# EAGLE design main (EAGLE 6.0)
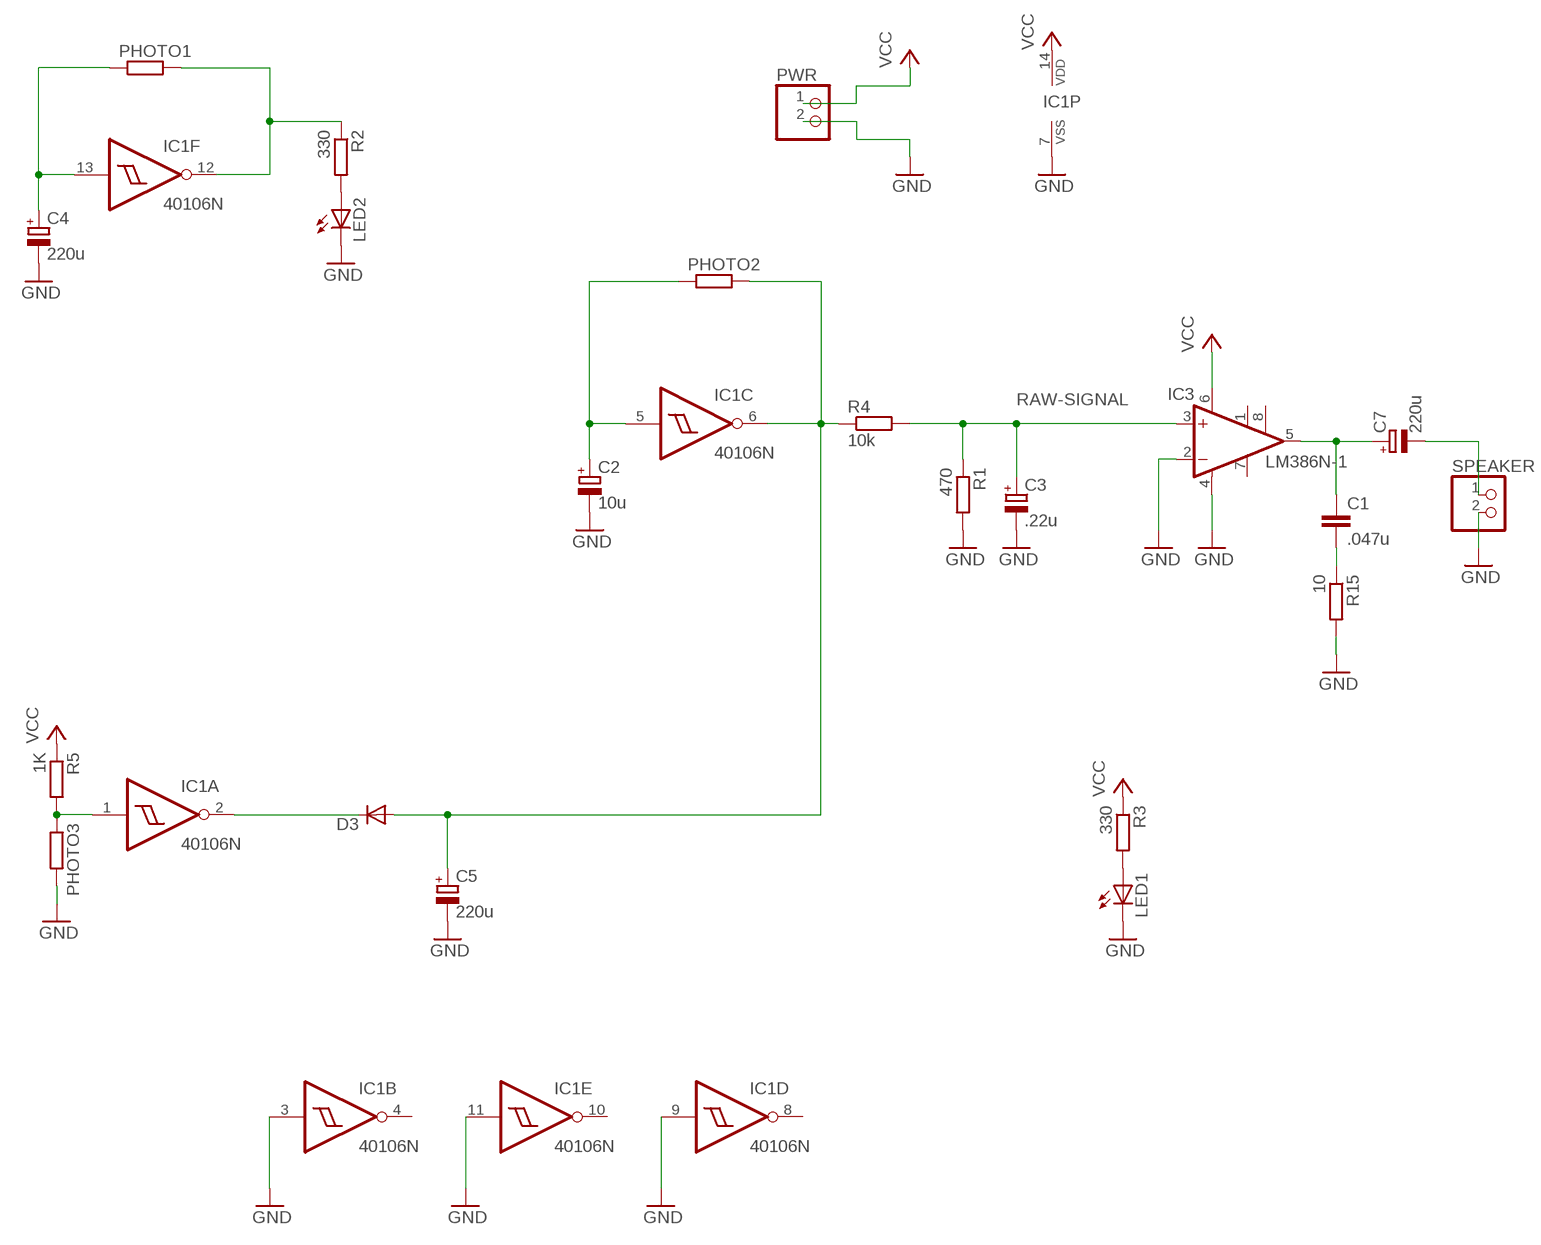
[diagram p0: schematic, sheet 1]

## Parts
C1  .047u  C-EU025-025X050  [C025-025X050]
C2  10u  CPOL-EUTT2D6  [TT2D6]
C3  .22u  CPOL-EUTT2D6  [TT2D6]
C4  220u  CPOL-EUTT2D6  [TT2D6]
C5  220u  CPOL-EUTT2D6  [TT2D6]
C7  220u  CPOL-EUTT2D6  [TT2D6]
D3  DIODE-DO35-10  [DO35-10]
IC1  40106N  [DIL14]
IC3  LM386N-1  [DIL08]
LED1  LED5MM  [LED5MM]
LED2  LED5MM  [LED5MM]
PHOTO1  R-EU_0207/5V  [0207/5V]
PHOTO2  R-EU_0207/5V  [0207/5V]
PHOTO3  R-EU_0207/5V  [0207/5V]
PWR  PINHD-1X2STRAIGHT  [1X02]
R1  470  R-EU_0207/10  [0207/10]
R2  330  R-EU_0207/10  [0207/10]
R3  330  R-EU_0207/10  [0207/10]
R4  10k  R-EU_0207/10  [0207/10]
R5  1K  R-EU_0207/10  [0207/10]
R15  10  R-EU_0207/10  [0207/10]
SPEAKER  PINHD-1X2STRAIGHT  [1X02]

## Nets
GND: C2.- C3.- C4.- C5.- IC1.3(B:I) IC1.7(P:VSS) IC1.9(D:I) IC1.11(E:I) IC3.2(-IN) IC3.4(GND) LED1.K(C) LED2.K(C) PHOTO3.2 PWR.2 R1.2 R15.2 SPEAKER.2
N$1: LED2.A R2.2
N$2: C2.+ IC1.5(C:I) PHOTO2.1
N$3: C4.+ IC1.13(F:I) PHOTO1.1
N$4: LED1.A R3.2
N$5: IC1.12(F:O) PHOTO1.2 R2.1
N$6: IC1.1(A:I) PHOTO3.1 R5.2
N$7: C5.+ D3.A IC1.6(C:O) PHOTO2.2 R4.1
N$13: D3.C IC1.2(A:O)
N$22: C1.1 C7.+ IC3.5(OUT)
N$23: C1.2 R15.1
OUT-SIGNAL: C7.- SPEAKER.1
RAW-SIGNAL: C3.+ IC3.3(+IN) R1.1 R4.2
VCC [power]: IC1.14(P:VDD) IC3.6(VS) PWR.1 R3.1 R5.1
Unconnected: IC1.4(B:O) IC1.8(D:O) IC1.10(E:O) IC3.1(GAIN) IC3.7(BYPASS) IC3.8(GAIN)

## Library data of the parts
C1 = rcl:C-EU: CAPACITOR, European symbol
C2-C5 C7 = rcl:CPOL-EU: POLARIZED CAPACITOR, European symbol
D3 = diode:DIODE-: DIODE
IC1 = 40xx:40106: Hex SCHMITT TRIGGER
IC3 = linear:LM386?-*: Low Voltage Audio Power Amplifier Source: http://cache.national.com/ds/LM/LM386.pdf
LED1 LED2 = led:LED: LED OSRAM: - CHIPLED LG R971, LG N971, LY N971, LG Q971, LY Q971, LO R971, LY R971 LH N974, LH R974 LS Q976, LO Q976, LY Q976 LO Q996 - Hyper CHIPLED LW Q18S LB Q993, LB Q99A, LB R99A - SideLED LS A670, LO A670, LY A670, LG A670, LP A670 LB A673, LV A673, LT A673, LW A673 LH A674 LY A675 LS A676, LA A676, LO A676, LY A676, LW A676 LS A679, LY A679, LG A679 - Hyper Micro SIDELED® LS Y876, LA Y876, LO Y876, LY Y876 LT Y87S - SmartLED LW L88C, LW L88S LB L89C, LB L89S, LG L890 LS L89K, LO L89K, LY L89K LS L896, LA L896, LO L896, LY L896 - TOPLED LS T670, LO T670, LY T670, LG T670, LP T670 LSG T670, LSP T670, LSY T670, LOP T670, LYG T670 LG T671, LOG T671, LSG T671 LB T673, LV T673, LT T673, LW T673 LH T674 LS T676, LA T676, LO T676, LY T676, LB T676, LH T676, LSB T676, LW T676 LB T67C, LV T67C, LT T67C, LS T67K, LO T67K, LY T67K, LW E67C LS E67B, LA E67B, LO E67B, LY E67B, LB E67C, LV E67C, LT E67C LW T67C LS T679, LY T679, LG T679 LS T770, LO T770, LY T770, LG T770, LP T770 LB T773, LV T773, LT T773, LW T773 LH T774 LS E675, LA E675, LY E675, LS T675 LS T776, LA T776, LO T776, LY T776, LB T776 LHGB T686 LT T68C, LB T68C - Hyper Mini TOPLED® LB M676 - Mini TOPLED Santana® LG M470 LS M47K, LO M47K, LY M47K Source: http://www.osram.convergy.de LUXEON: - LUMILED® LXK2-PW12-R00, LXK2-PW12-S00, LXK2-PW14-U00, LXK2-PW14-V00 LXK2-PM12-R00, LXK2-PM12-S00, LXK2-PM14-U00 LXK2-PE12-Q00, LXK2-PE12-R00, LXK2-PE12-S00, LXK2-PE14-T00, LXK2-PE14-U00 LXK2-PB12-K00, LXK2-PB12-L00, LXK2-PB12-M00, LXK2-PB14-N00, LXK2-PB14-P00, LXK2-PB14-Q00 LXK2-PR12-L00, LXK2-PR12-M00, LXK2-PR14-Q00, LXK2-PR14-R00 LXK2-PD12-Q00, LXK2-PD12-R00, LXK2-PD12-S00 LXK2-PH12-R00, LXK2-PH12-S00 LXK2-PL12-P00, LXK2-PL12-Q00, LXK2-PL12-R00 Source: www.luxeon.com KINGBRIGHT: KA-3528ASYC Source: www.kingbright.com
PHOTO1-PHOTO3 R1-R5 R15 = rcl:R-EU_: RESISTOR, European symbol
PWR SPEAKER = pinhead:PINHD-1X2: PIN HEADER

## Net classes
0 default: width 0.305 mm, clearance 0.305 mm
1 power: width 0.305 mm, clearance 0.305 mm

## Board
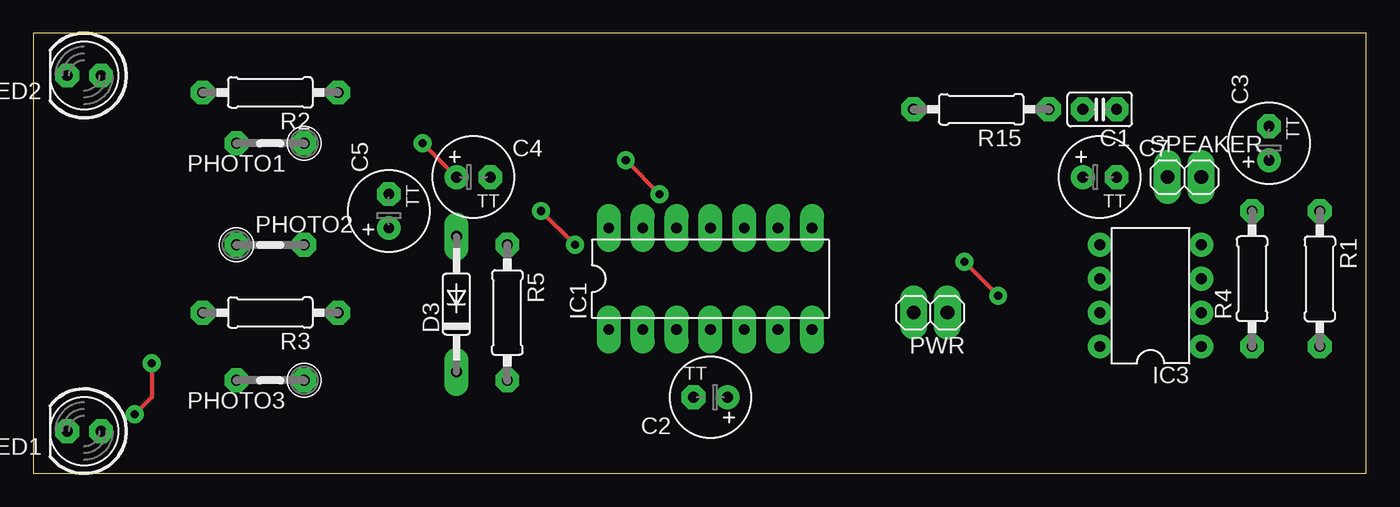
[diagram p1: board, top side]
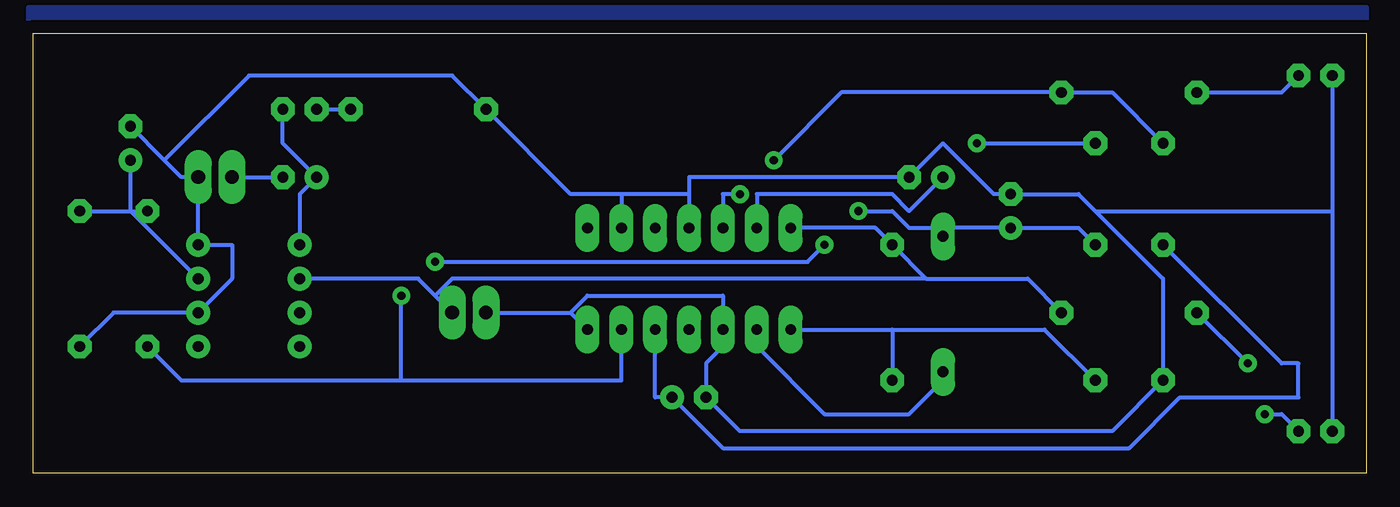
[diagram p2: board, bottom side, seen from below]

Size 100 x 33.01 mm. Coordinates in mm from the lower left corner, seen from the top.
Outline: 0,0 100,0 100,33.01 0,33.01 0,0
Copper layers (1*16): Top 0.035mm / dielectric 1.5mm / Bottom 0.035mm
Design rules: minimum track width 10mil, minimum drill 24mil, track to track 8mil, track to pad 8mil, pad to pad 8mil, via to via 8mil, smd to smd 8mil, copper to edge 40mil, drill to drill 8mil, minimum pad ring 10mil, minimum via ring 8mil, stop-mask expansion 4mil, vias tented up to drill 0mil, thermal gap 10mil

### Footprints (pad centres in the part's own frame; a part is rotated, then mirrored left to right if it is on the bottom)
C025-025X050 = drill 0.813 octagon: 1 -1.27,0; 2 1.27,0
TT2D6 = drill 0.813: + -1.27,0 | drill 0.813 octagon: - 1.27,0
DO35-10 = drill 0.813 long: A 5.08,0; C -5.08,0
DIL14 = drill 0.813 long: 1 -7.62,-3.81; 2 -5.08,-3.81; 3 -2.54,-3.81; 4 0,-3.81; 5 2.54,-3.81; 6 5.08,-3.81; 7 7.62,-3.81; 8 7.62,3.81; 9 5.08,3.81; 10 2.54,3.81; 11 0,3.81; 12 -2.54,3.81; 13 -5.08,3.81; 14 -7.62,3.81
DIL08 = drill 0.813 pad 1.27: 1 -3.81,-3.81; 2 -1.27,-3.81; 3 1.27,-3.81; 4 3.81,-3.81; 5 3.81,3.81; 6 1.27,3.81; 7 -1.27,3.81; 8 -3.81,3.81
LED5MM = drill 0.813 octagon: A -1.27,0; K 1.27,0
0207/5V = drill 0.813 octagon: 1 -2.54,0; 2 2.54,0
1X02 = drill 1.016 long: 1 -1.27,0; 2 1.27,0
0207/10 = drill 0.813 octagon: 1 -5.08,0; 2 5.08,0

### Placement (x,y rotation side)
C1  80.01,27.3 180 top
C2  50.8,5.72 180 top
C3  92.71,24.77 90 top
C4  33.02,22.23 0 top
C5  26.67,19.69 90 top
C7  80.01,22.23 0 top
D3  31.75,12.7 90 top
IC1  50.8,14.61 0 top
IC3  83.82,13.34 90 top
LED1  3.81,3.18 180 top
LED2  3.81,29.84 180 top
PHOTO1  17.78,24.77 180 top
PHOTO2  17.78,17.15 0 top
PHOTO3  17.78,6.99 180 top
PWR  67.31,12.07 180 top
R1  96.52,14.61 270 top
R2  17.78,28.58 180 top
R3  17.78,12.07 180 top
R4  91.44,14.61 90 top
R5  35.56,12.07 270 top
R15  71.12,27.3 180 top
SPEAKER  86.36,22.23 0 top

### Tracks (layer width: path | path; a pad name or v marks a point on that pad's centre or on a via)
GND
  Bottom 0.305: 90.17,23.5 88.9,22.23 SPEAKER.2 IC3.4 85.09,17.15 85.09,14.61 IC3.2 93.98,12.07 R1.2 | 90.17,23.5 C3.- | 50.8,20.95 50.8,22.23 C4.- 31.75,24.77 27.94,20.95 C5.- 21.59,20.95 20.32,19.69 | 50.8,20.95 IC1.11 | 55.88,20.95 IC1.9 | 50.8,20.95 55.88,20.95 | 55.88,20.95 59.69,20.95 R15.2 68.58,29.84 83.82,29.84 90.17,23.5 | LED2.K 2.54,19.69 | 2.54,19.69 LED1.K | 59.69,12.07 IC1.7 | PWR.2 59.69,12.07 | 59.69,12.07 58.42,13.34 48.26,13.34 IC1.3 48.26,9.53 49.53,8.26 C2.- 46.99,3.18 19.05,3.18 PHOTO3.2 15.24,14.61 20.32,19.69 | 20.32,19.69 2.54,19.69
  pour Bottom: 0,33.66 99.06,33.66 100.33,32.39 100.33,34.93 0,34.93
N$1
  Bottom 0.305: LED2.A 6.35,28.58 R2.2
N$2
  Bottom 0.305: PHOTO2.1 6.35,8.26 5.08,8.26 5.08,5.72 13.97,5.72 17.78,1.91 48.26,1.91 C2.+ 53.34,5.72 IC1.5
N$3  (via drill 0.61)
  Top 0.305: C4.+ v29.21,24.77
  Bottom 0.305: v29.21,24.77 PHOTO1.1 | IC1.13 45.72,20.95 35.56,20.95 34.29,19.69 C4.+
N$4  (via drill 0.61)
  Top 0.305: v7.62,4.45 8.89,5.72 v8.89,8.26
  Bottom 0.305: LED1.A 6.35,4.45 v7.62,4.45 | R3.2 v8.89,8.26
N$5  (via drill 0.61)
  Top 0.305: v44.45,23.5 v46.99,20.95
  Bottom 0.305: PHOTO1.2 19.05,28.58 R2.1 39.37,28.58 v44.45,23.5 | IC1.12 48.26,20.95 v46.99,20.95
N$6
  Bottom 0.305: PHOTO3.1 24.13,10.8 35.56,10.8 | IC1.1 35.56,10.8 | 35.56,10.8 R5.2
N$7  (via drill 0.61)
  Top 0.305: v40.64,17.15 v38.1,19.69 | v72.39,13.34 v69.85,15.88
  Bottom 0.305: PHOTO2.2 21.59,18.41 C5.+ 31.75,18.41 | IC1.6 55.88,6.99 72.39,6.99 | 72.39,6.99 88.9,6.99 R4.1 | 31.75,18.41 34.29,18.41 35.56,19.69 v38.1,19.69 | v40.64,17.15 41.91,15.88 v69.85,15.88 | 72.39,6.99 v72.39,13.34 | 31.75,18.41 D3.A
N$13
  Bottom 0.305: IC1.2 45.72,9.53 40.64,4.45 34.29,4.45 31.75,6.99 D3.C
N$22
  Bottom 0.305: IC3.5 80.01,20.95 C7.+ 81.28,24.77 C1.1
N$23
  Bottom 0.305: C1.2 R15.1
OUT-SIGNAL
  Bottom 0.305: SPEAKER.1 C7.-
RAW-SIGNAL
  Bottom 0.305: 92.71,19.69 IC3.3 | R1.1 92.71,19.69 | 92.71,19.69 R4.2 | 92.71,19.69 C3.+
VCC
  Bottom 0.305: IC3.6 71.12,14.61 69.85,13.34 | PWR.1 69.85,13.34 | R3.1 25.4,14.61 33.02,14.61 | 33.02,14.61 R5.1 36.83,18.41 IC1.14 | 69.85,13.34 68.58,14.61 33.02,14.61